# EAGLE design Simple_Boost_AA_to_1V8 (EAGLE 7.2.0)
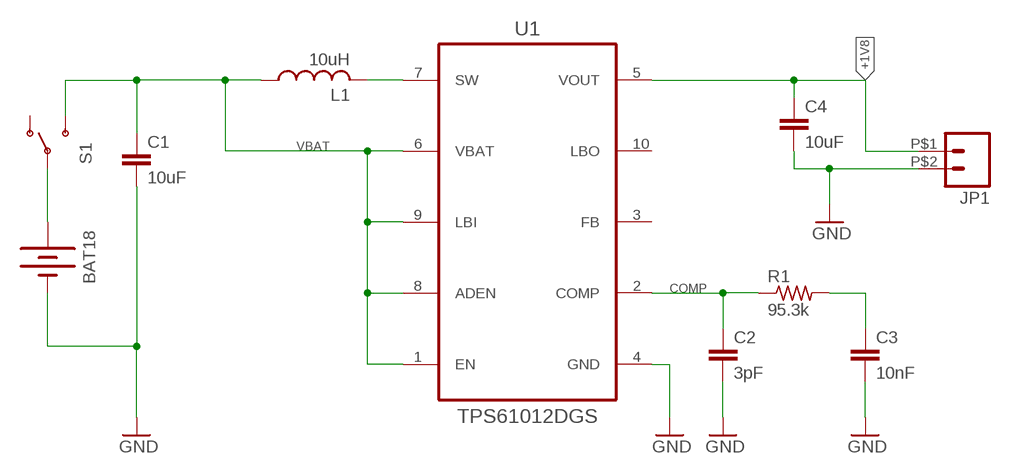
[diagram p0: schematic, sheet 1]

## Parts
BAT18  BATTERYAA  [BATTERY-AA]
C1  10uF  C-EUC1812  [C1812]
C2  3pF  C-EUC0805  [C0805]
C3  10nF  C-EUC0805  [C0805]
C4  10uF  C-EUC1812  [C1812]
JP1  M02TE-282834-2  [1X02_282834-2]
L1  10uH  SUMIDA_POWER_INDUCTOR6  [CDRH6D38]
R1  95.3k  R-US_R0805  [R0805]
S1  SWITCH-SPDTPTH  [SWITCH-SPDT]
U1  TPS61012DGS  [SOP50P490X110-10N]

## Nets
+1V8: C4.1 JP1.P$1 U1.5(VOUT)
COMP: C2.1 R1.1 U1.2(COMP)
GND: BAT18.GND@1(-) BAT18.GND@2(-) C1.2 C2.2 C3.2 C4.2 JP1.P$2 U1.4(GND)
N$1: C3.1 R1.2
N$2: BAT18.PWR@1(+) BAT18.PWR@2(+) S1.2(P)
SW: L1.P$2 U1.7(SW)
VBAT: C1.1 L1.P$1 S1.3(S) U1.1(EN) U1.6(VBAT) U1.8(ADEN) U1.9(LBI)
Unconnected: S1.1(O) U1.3(FB) U1.10(LBO)

## Library data of the parts
BAT18 = DensityAltitude:BATTERY: Battery Holders Various common sizes : AA, AAA, 18650 (PRT-12895), 20mm coin cell and 12mm coin cell. 20MM_4LEGS, BATT-10373
C1-C4 = rcl:C-EU: CAPACITOR, European symbol
JP1 = DensityAltitude:M02: Standard 2-pin 0.1" header. Use with - straight break away headers ( PRT-00116) - right angle break away headers (PRT-00553) - swiss pins (PRT-00743) - machine pins (PRT-00117) - female headers (PRT-00115) Molex polarized connector foot print use with: PRT-08233 with associated crimp pins and housings. 2.54_SCREWTERM for use with PRT-10571. 3.5mm Screw Terminal footprints for PRT-08084 5mm Screw Terminal footprints for use with PRT-08432
L1 = DensityAltitude:SUMIDA_POWER_INDUCTOR
R1 = rcl:R-US_: RESISTOR, American symbol
S1 = SparkFun-Electromechanical:SWITCH-SPDT: SPDT Switch Simple slide switch, Spark Fun Electronics SKU : COM-00102 DPDT SMT slide switch, AYZ0202, SWCH-08179; PROD_ID: SWCH-08261
U1 = DensityAltitude:TPS6101*: 1-CELL AND 2-CELL BOOST CONVERTERS; PACKAGE: MSOP-10; SUPPLIER: Texas Instruments; VOLTAGE: 1.8

## Net classes
1 big_power: width 1.93 mm

## Board
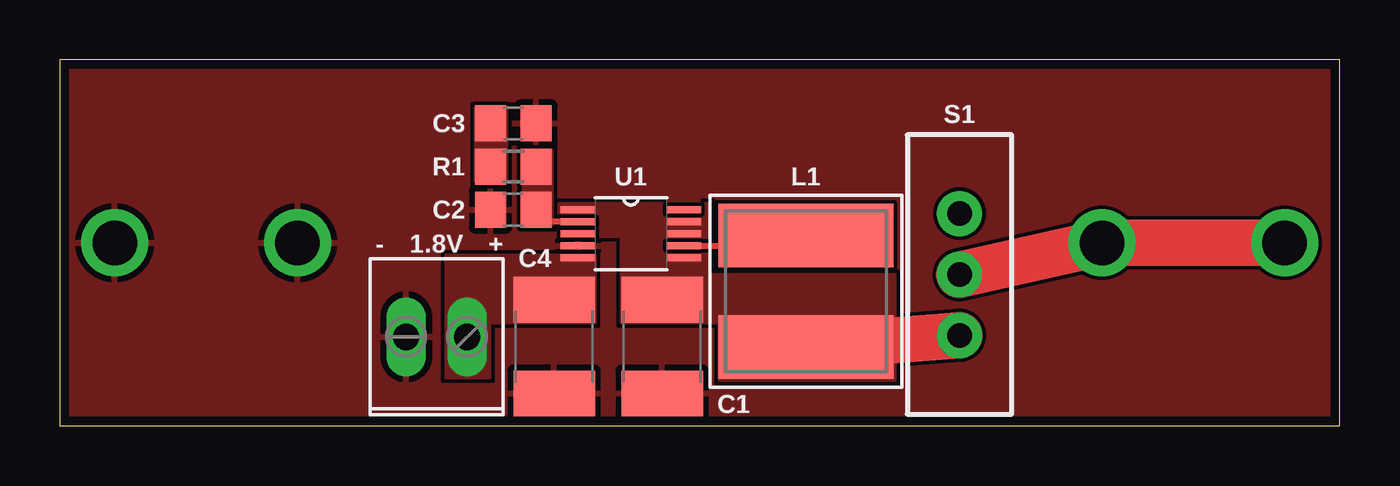
[diagram p1: board, top side]
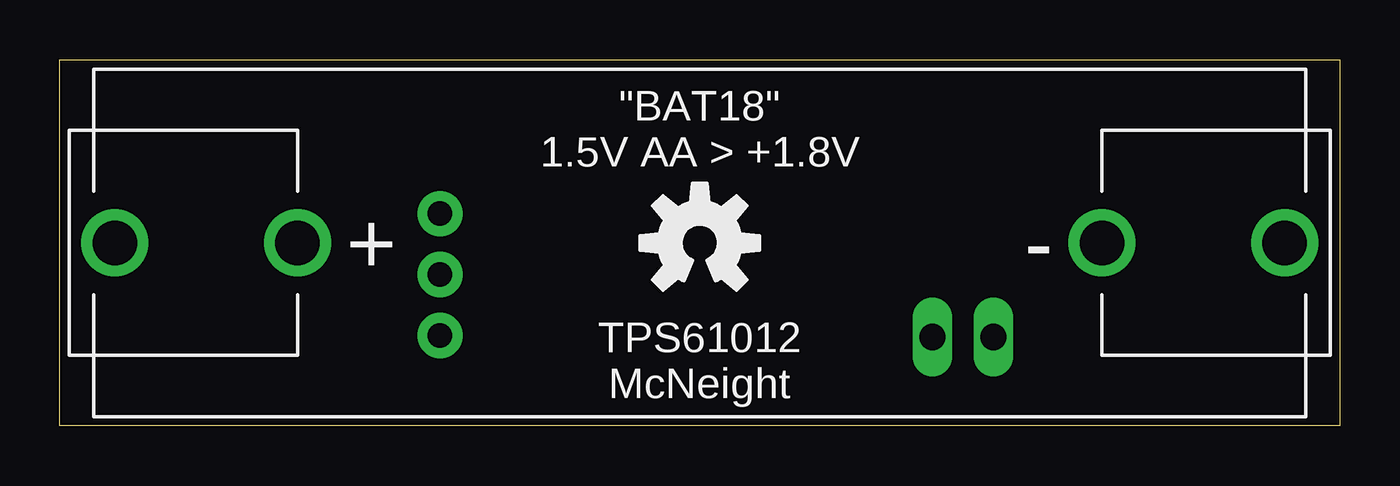
[diagram p2: board, bottom side, seen from below]

Size 53.34 x 15.24 mm. Coordinates in mm from the lower left corner, seen from the top.
Outline: 0,0 53.34,0 53.34,15.24 0,15.24 0,0
Copper layers (1*16): Top 0.0356mm / dielectric 1.5011mm / Bottom 0.0356mm
Design rules "oshpark-2layer": minimum track width 6mil, minimum drill 13mil, track to track 6mil, track to pad 6mil, pad to pad 6mil, via to via 6mil, smd to smd 6mil, copper to edge 15mil, drill to drill 6mil, minimum pad ring 7mil, minimum via ring 7mil, stop-mask expansion 4mil, vias tented up to drill 0mil, thermal gap 10mil

### Footprints (pad centres in the part's own frame; a part is rotated, then mirrored left to right if it is on the bottom)
BATTERY-AA = drill 1.854: GND@1 24.384,0; GND@2 16.764,0; PWR@1 -24.384,0; PWR@2 -16.764,0
C1812 = smd 1.9 x 3.4: 1 -1.95,0; 2 1.95,0
C0805 = smd 1.3 x 1.5: 1 -0.95,0; 2 0.95,0
1X02_282834-2 = drill 1.1 long: P$1 -1.27,0; P$2 1.27,0
CDRH6D38 = smd 2.65 x 7.3: P$1 -2.325,0; P$2 2.325,0
R0805 = smd 1.3 x 1.5: 1 -0.95,0; 2 0.95,0
SWITCH-SPDT = drill 1.016 pad 1.88: 1 0,2.54; 2 0,0; 3 0,-2.54
SOP50P490X110-10N = smd 1.45 x 0.3: 1 -2.2,1; 2 -2.2,0.5; 3 -2.2,0; 4 -2.2,-0.5; 5 -2.2,-1; 6 2.2,-1; 7 2.2,-0.5; 8 2.2,0; 9 2.2,0.5; 10 2.2,1

### Placement (x,y rotation side)
BAT18  26.67,7.62 0 bottom
C1  25.1,3.3 270 top
C2  18.9,9 180 top
C3  18.9,12.6 0 top
C4  20.6,3.3 270 top
JP1  15.7,3.7 180 top
L1  31.1,5.6 90 top
R1  18.9,10.8 180 top
S1  37.5,6.3 0 top
U1  23.8,8 0 top
U$1  [OSHW-LOGO-M]  26.67,7.62 0 bottom

### Tracks (layer width: path | path; a pad name or v marks a point on that pad's centre or on a via)
+1V8
  pour Top (no thermals): 22.3,4.3 17.9,4.3 17.9,2 16.1,2 16.1,7.1 22.3,7.1
COMP
  Top 0.254: U1.2 20.36,8.5 C2.1
  pour Top (no thermals): 19.32,8.38 20.52,8.38 20.52,11.48 19.32,11.48
GND
  pour Top (rank 2): 0,0 0,15.24 53.34,15.24 53.34,0
N$1
  pour Top (no thermals): 17.32,10.18 18.62,10.18 18.62,13.28 17.32,13.28
N$2
  Top 1.93: S1.2 BAT18.PWR@2 BAT18.PWR@1
SW
  Top 0.254: U1.7 31.07,7.5 L1.P$2
VBAT
  Top 1.93: S1.3 L1.P$1
  pour Top (no thermals): 34.8,6.3 27.1,6.3 27.1,9.25 20.8,9.25 20.8,7.9 23.4,7.9 23.4,4.3 27.5,4.3 27.5,1.9 34.8,1.9

### Text on the board
tPlace: - | 1.8V | +
bPlace: "BAT18" / 1.5V AA > +1.8V | TPS61012 / McNeight